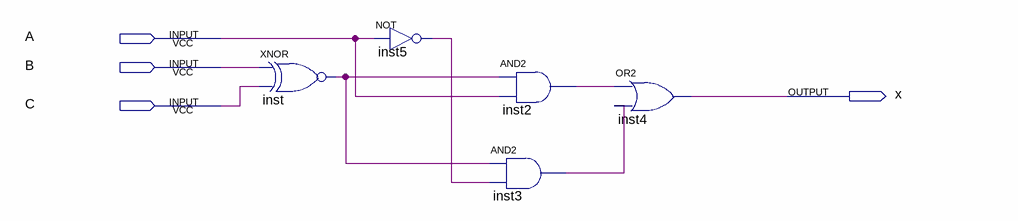
[diagram p0: schematic sheet]
// Quartus schematic principal.bdf as structural Verilog: 5 symbols, 4 pins
module principal (
  input  A,
  input  B,
  input  C,
  output x
);

  wire inst2_out, inst3_out, inst5_out, inst_out;

  xnor inst (inst_out, B, C);
  not inst5 (inst5_out, A);
  and inst3 (inst3_out, inst_out, inst5_out);
  and inst2 (inst2_out, inst_out, A);
  or inst4 (x, inst2_out, inst3_out);
endmodule
